# EAGLE design harp expander servo driver v1.0 (EAGLE 9.6.2)
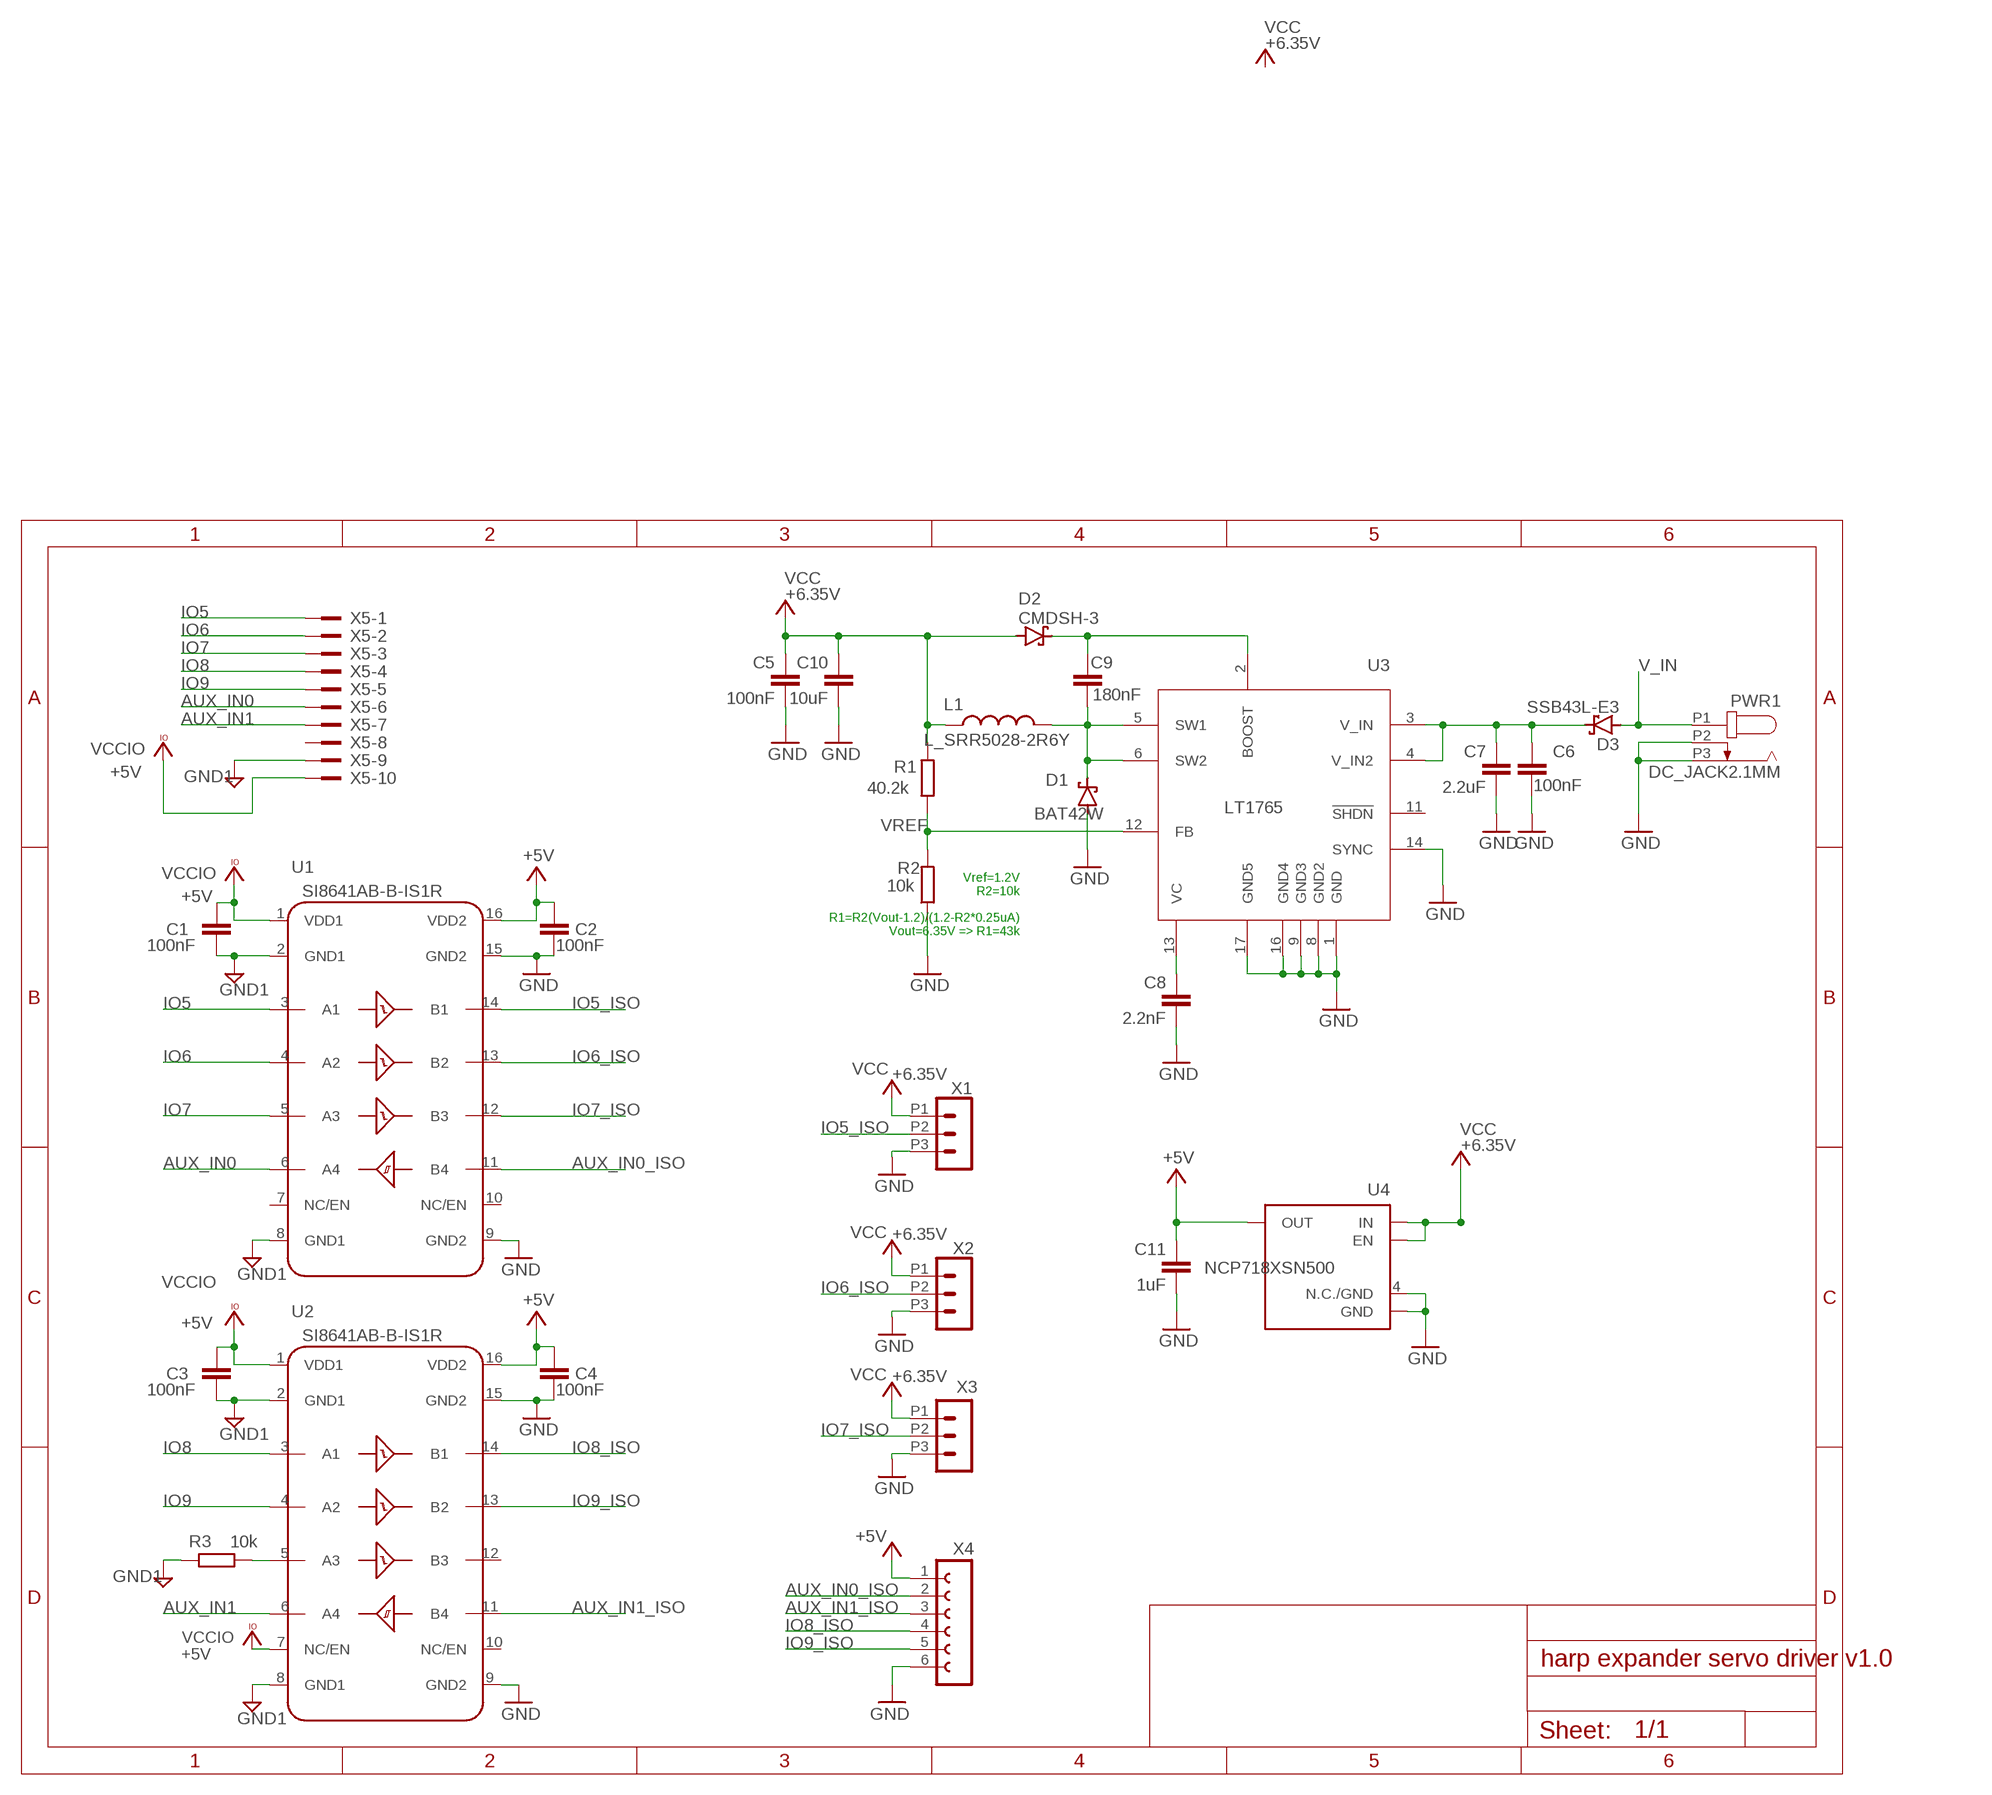
[diagram p0: schematic, sheet 1]

## Parts
C1  100nF  C-EUC0402  [C0402]
C2  100nF  C-EUC0402  [C0402]
C3  100nF  C-EUC0402  [C0402]
C4  100nF  C-EUC0402  [C0402]
C5  100nF  C-EUC0402  [C0402]
C6  100nF  C-EUC0402  [C0402]
C7  2.2uF  C-EUC0603  [C0603]
C8  2.2nF  C-EUC0402  [C0402]
C9  180nF  C-EUC0603  [C0603]
C10  10uF  C-EUC0603  [C0603]
C11  1uF  C-EUC0603  [C0603]
D1  BAT42W  SCHOTTKY-DIODECASE457  [POWERMITE]
D2  CMDSH-3  SCHOTTKY-DIODESOD323  [SOD323-R]
D3  SSB43L-E3  MBRS130LT3  [SMB]
L1  L_SRR5028-2R6Y  [COILCRAFT_1]
PWR1  DC_JACK2.1MM  [DC_POWER_INPUT_2.1MM]
R1  40.2k  R-EU_R0402  [R0402]
R2  10k  R-EU_R0402  [R0402]
R3  10k  R-EU_R0402  [R0402]
U1  SI8641AB-B-IS1R  SI8641ABW  [SO16W]
U2  SI8641AB-B-IS1R  SI8641ABW  [SO16W]
U3  LT1765  [TSSOP16]
U4  NCP718XSN500  [SOT23-5]
X1  CON_3.5MM_1X3  [CON_3.5MM_1X3]
X2  CON_3.5MM_1X3  [CON_3.5MM_1X3]
X3  CON_3.5MM_1X3  [CON_3.5MM_1X3]
X4  aux_header  FE06-1  [FE06]
X5  2510-  [PAK100/2500-10]

## Nets
+5V: C2.1 C4.1 C11.1 U1.16(VDD2) U2.16(VDD2) U4.5(OUT) X4.1
AUX_IN0: U1.6(A4) X5.6
AUX_IN0_ISO: U1.11(B4) X4.2
AUX_IN1: U2.6(A4) X5.7
AUX_IN1_ISO: U2.11(B4) X4.3
GND: C2.2 C4.2 C5.2 C6.2 C7.2 C8.2 C10.2 C11.2 D1.2(A) PWR1.P2 PWR1.P3 R2.1 U1.9(GND2) U1.15(GND2) U2.9(GND2) U2.15(GND2) U3.1(GND) U3.8(GND2) U3.9(GND3) U3.14(SYNC) U3.16(GND4) U3.17(GND5) U4.2(GND) U4.4(N.C./GND) X1.P3 X2.P3 X3.P3 X4.6
GND1: C1.2 C3.2 R3.2 U1.2(GND1) U1.8(GND1) U2.2(GND1) U2.8(GND1) X5.9
IO5: U1.3(A1) X5.1
IO5_ISO: U1.14(B1) X1.P2
IO6: U1.4(A2) X5.2
IO6_ISO: U1.13(B2) X2.P2
IO7: U1.5(A3) X5.3
IO7_ISO: U1.12(B3) X3.P2
IO8: U2.3(A1) X5.4
IO8_ISO: U2.14(B1) X4.4
IO9: U2.4(A2) X5.5
IO9_ISO: U2.13(B2) X4.5
N$2: C6.1 C7.1 D3.C U3.3(V_IN) U3.4(V_IN2)
N$9: R3.1 U2.5(A3)
N$10: C8.1 U3.13(VC)
N$17: C9.2 D1.1(C) L1.2 U3.5(SW1) U3.6(SW2)
N$19: C9.1 D2.C U3.2(BOOST)
V_IN: D3.A PWR1.P1
VCC: C5.1 C10.1 D2.A L1.1 R1.2 U4.1(IN) U4.3(EN) X1.P1 X2.P1 X3.P1
VCCIO: C1.1 C3.1 U1.1(VDD1) U2.1(VDD1) U2.7(NC/EN) X5.10
VREF: R1.1 R2.2 U3.12(FB)
Unconnected: U1.7(NC/EN) U1.10(NC/EN) U2.10(NC/EN) U2.12(B3) U3.7(NC7) U3.10(NC10) U3.11(!SHDN) U3.15(NC15) X5.8

## Notes on the sheet
- Vref=1.2V
  R2=10k
  
  R1=R2(Vout-1.2)/(1.2-R2*0.25uA)
  Vout=6.35V => R1=43k

## Library data of the parts
C1-C6 = rcl:C-EU: CAPACITOR, European symbol; DIGIKEY_PN: 445-6899-2-ND; MPN: CGA2B3X7R1H104K050BB; TYPE: SMD
C7 = rcl:C-EU: CAPACITOR, European symbol; DIGIKEY_PN: 490-12738-1-ND; MPN: GRM188R61E225MA12D; TYPE: SMD
C8 = rcl:C-EU: CAPACITOR, European symbol; DIGIKEY_PN: 1276-1532-6-ND; MPN: CL05B222JB5NNNC; TYPE: SMD
C9 = rcl:C-EU: CAPACITOR, European symbol; DIGIKEY_PN: 490-GCG188R91H184KA01DCT-ND; MPN: GCG188R91H184KA01D; TYPE: SMD
C10 = rcl:C-EU: CAPACITOR, European symbol; DIGIKEY_PN: 587-3238-1-ND; MPN: EMK107BBJ106MA-T; TYPE: SMD
C11 = rcl:C-EU: CAPACITOR, European symbol; DIGIKEY_PN: 1276-1184-1-ND; MPN: CL10B105KA8NNNC; TYPE: SMD
D1 = harp expander servo driver v1.0:SCHOTTKY-DIODE: Schottky Diode; DIGIKEY_PN: BAT42W-E3-08CT-ND; MPN: BAT42W-E3-08; TYPE: SMD
D2 = harp expander servo driver v1.0:SCHOTTKY-DIODE: Schottky Diode; DIGIKEY_PN: 1514-CMDSH-3TRPBFREECT-ND; MPN: CMDSH-3; TYPE: SMD
D3 = diode:MBRS130LT3: Schottky Power Rectifier Source: http://www.onsemi.com/pub/Collateral/MBRS130LT3-D.PDF; DIGIKEY_PN: SSB43L-E3/52TGICT-ND; MPN: SSB43L-E3/52T; VALUE2: DIODE SCHOTTKY 30V 4A DO214AA
L1 = harp expander servo driver v1.0:L_SRR5028-2R6Y; DIGIKEY_PN: SRR5028-2R6YCT-ND; MOUSER_PN: 652-SRR5028-2R6Y; MPN: SRR5028-2R6Y; VALUE2: 2.6uH 3A
PWR1 = harp expander servo driver v1.0:DC_JACK; DIGIKEY_PN: 163-179PH-EX MOUSER; MPN: 163-179PH-EX
R1 = rcl:R-EU_: RESISTOR, European symbol; DIGIKEY_PN: 311-40.2KLRCT-ND; MPN: RC0402FR-0740K2L; TYPE: SMD
R2 R3 = rcl:R-EU_: RESISTOR, European symbol; DIGIKEY_PN: 541-3959-1-ND; MPN: CRCW040210K0FKEDC; TYPE: SMD
U1 U2 = harp expander servo driver v1.0:SI8641AB; DIGIKEY_PN: 336-5212-1-ND; MOUSER_PN: 634-SI8641AB-B-IS1R; MPN: SI8641AB-B-IS1R
U3 = harp expander servo driver v1.0:LT1765; DESCRIPTION: Buck Switching Regulator Output 3A; DIGIKEY_PN: LT1765EFE#TRPBFCT-ND; MPN: LT1765EFE#TRPBF
U4 = harp expander servo driver v1.0:NCP718XSN500; DIGIKEY_PN: NCP718BSN500T1GOSCT-ND; MPN: NCP718BSN500T1G
X1-X3 = harp expander servo driver v1.0:CON_3.5MM_1X3; DIGIKEY_PN: 732-2770-ND; MPN: 691322110003
X4 = con-lsta:FE06-1: FEMALE HEADER; MPN: n.a.; OC_FARNELL: unknown; OC_NEWARK: unknown
X5 = con-3m:2510-: 3M (TM) Pak 100 4-Wall Header Source: 3M; DIGIKEY_PN: S9169-ND; MF: -; MPN: SBH11-PBPC-D05-ST-BK; OC_FARNELL: -; OC_NEWARK: -

## Board
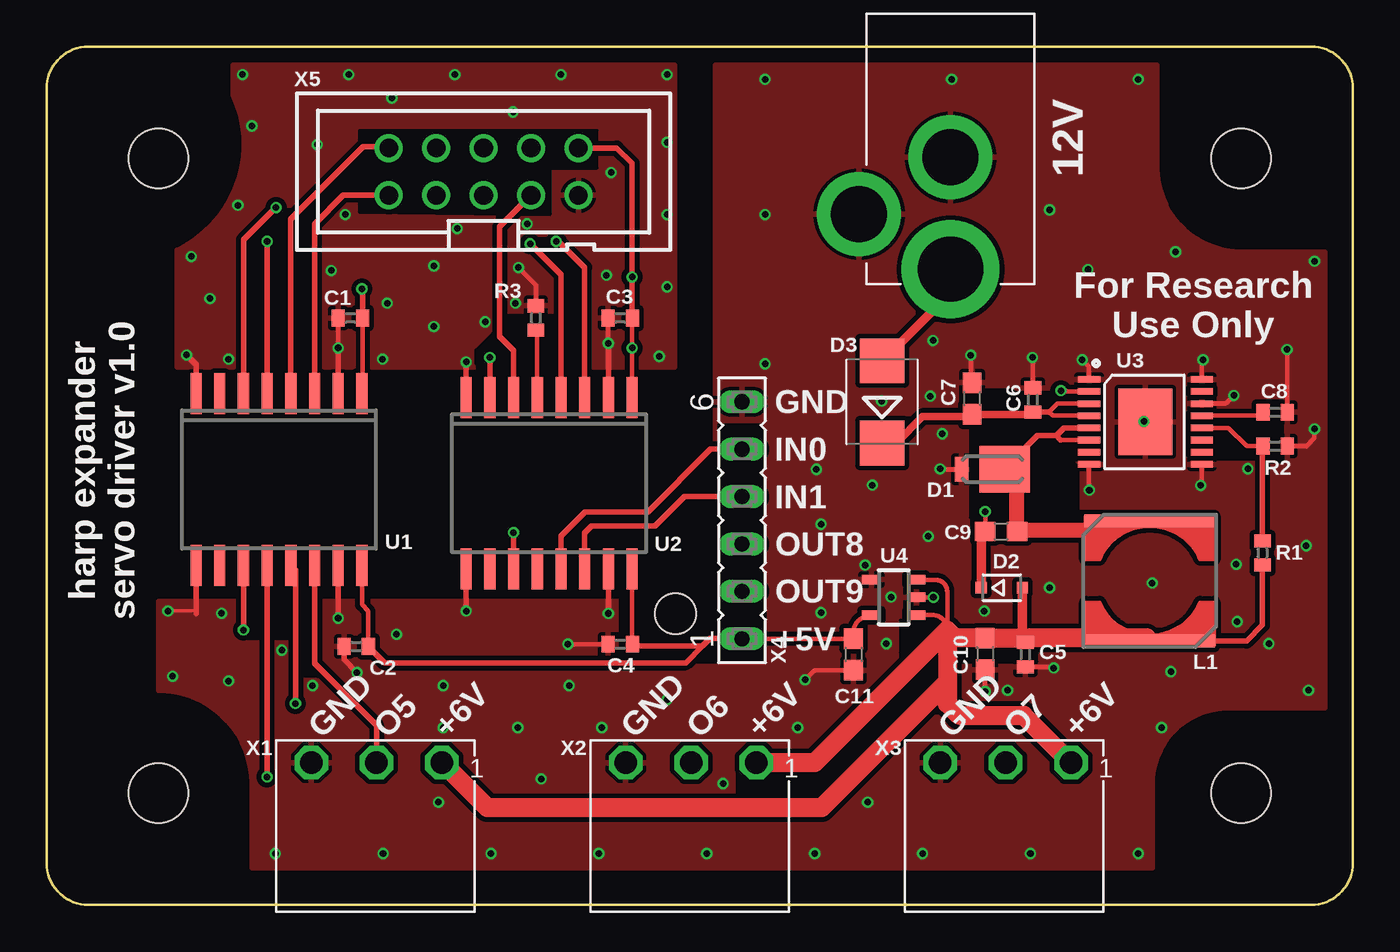
[diagram p1: board, top side]
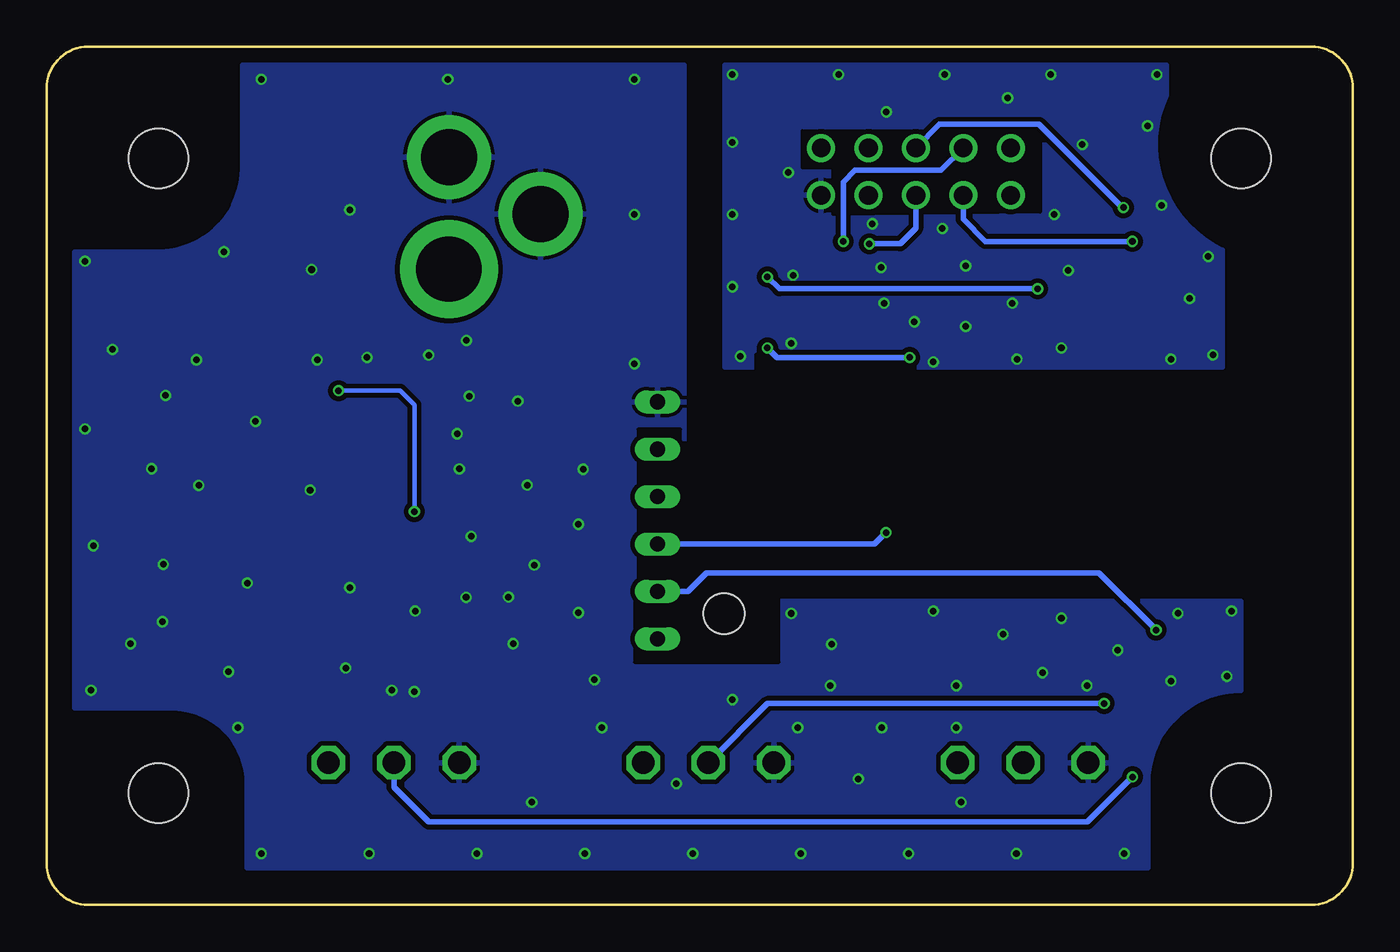
[diagram p2: board, bottom side, seen from below]

Size 70 x 46 mm. Coordinates in mm from the lower left corner, seen from the top.
Outline: 67.76,46 2.24,46 arc90 0,43.76 0,2.24 arc90 2.24,0 67.76,0 arc90 70,2.24 70,43.76 arc90 67.76,46
Copper layers (1*16): Top 0.018mm / dielectric 1.55mm / Bottom 0.018mm
Design rules "eC_2Layer_PClass6_BaseCopperO18_eCDefault *": minimum track width 6mil, minimum drill 0.35mm, track to track 6mil, track to pad 6mil, pad to pad 6mil, via to via 6mil, smd to smd 0mil, copper to edge 0.25mm, drill to drill 0.35mm, minimum pad ring 0.175mm, minimum via ring 0.125mm, stop-mask expansion 0mil, vias tented up to drill 0.45mm, thermal gap 0.2mm
Holes 3.2 mm at 6,40 6,6 64,6 64,40
Holes 2.2 mm at 33.71,15.61

### Footprints (pad centres in the part's own frame; a part is rotated, then mirrored left to right if it is on the bottom)
C0402 = smd 0.7 x 0.9: 1 -0.65,0; 2 0.65,0
C0603 = smd 1.1 x 1: 1 -0.85,0; 2 0.85,0
POWERMITE = smd 2.7 x 2.5: 1 -0.635,0 | smd 0.7 x 1.3: 2 1.665,0
SOD323-R = smd 0.6 x 0.6: A 1.1,0; C -1.1,0
SMB = smd 2.4 x 2.4: A 2.2,0; C -2.2,0
COILCRAFT_1 = smd 6.985 x 0.686: 1 0,3.225; 2 0,-3.225
DC_POWER_INPUT_2.1MM = drill 3.5: P1 8.5,0 | drill 3: P2 2.5,0; P3 5.55,-4.9
R0402 = smd 0.7 x 0.9: 1 -0.65,0; 2 0.65,0
SO16W = smd 0.6 x 2.2: 1 -4.445,-4.6; 2 -3.175,-4.6; 3 -1.905,-4.6; 4 -0.635,-4.6; 5 0.635,-4.6; 6 1.905,-4.6; 7 3.175,-4.6; 8 4.445,-4.6; 9 4.445,4.6; 10 3.175,4.6; 11 1.905,4.6; 12 0.635,4.6; 13 -0.635,4.6; 14 -1.905,4.6; 15 -3.175,4.6; 16 -4.445,4.6
TSSOP16 = smd 0.35 x 1.2: 1 -2.159,-2.897; 2 -1.504,-2.897; 3 -0.854,-2.897; 4 -0.204,-2.897; 5 0.446,-2.897; 6 1.096,-2.897; 7 1.746,-2.897; 8 2.396,-2.897; 9 2.396,3.148; 10 1.746,3.148; 11 1.096,3.148; 12 0.446,3.148; 13 -0.204,3.148; 14 -0.854,3.148; 15 -1.504,3.148; 16 -2.154,3.148 | smd 3.58 x 2.9: 17 0.121,0.126
SOT23-5 = smd 0.5 x 1: 1 -0.95,-1.2; 2 0,-1.2; 3 0.95,-1.2; 4 0.95,1.2; 5 -0.95,1.2
CON_3.5MM_1X3 = drill 1.2 octagon: P1 -3.5,0; P2 0,0; P3 3.5,0
FE06 = drill 0.813 long: 1 -6.35,0; 2 -3.81,0; 3 -1.27,0; 4 1.27,0; 5 3.81,0; 6 6.35,0
PAK100/2500-10 = drill 1 pad 1.422: 1 -5.08,-1.27; 2 -5.08,1.27; 3 -2.54,-1.27; 4 -2.54,1.27; 5 0,-1.27; 6 0,1.27; 7 2.54,-1.27; 8 2.54,1.27; 9 5.08,-1.27; 10 5.08,1.27

### Placement (x,y rotation side)
C1  16.28,31.46 180 top
C2  16.59,13.85 180 top
C3  30.74,31.46 180 top
C4  30.74,13.97 180 top
C5  52.45,13.41 270 top
C6  52.85,27.06 90 top
C7  49.6,27.14 90 top
C8  65.84,26.41 0 top
C9  51.15,20.02 0 top
C10  50.29,13.45 270 top
C11  43.24,13.43 270 top
D1  50.7,23.35 180 top
D2  51.18,17 0 top
D3  44.77,26.96 90 top
L1  59.12,17.37 180 top
PWR1  48.44,42.57 270 top
R1  65.16,18.86 270 top
R2  65.84,24.59 180 top
R3  26.22,31.46 90 top
U1  12.45,22.8 180 top
U2  26.93,22.6 180 top
U3  58.76,26.01 270 top
U4  45.4,16.48 90 top
X1  17.68,7.62 180 top
X2  34.54,7.62 180 top
X3  51.39,7.62 180 top
X4  37.26,20.61 90 top
X5  23.42,39.3 0 top

### Tracks (layer width: path | path; a pad name or v marks a point on that pad's centre or on a via)
+5V
  Top 0.254: X4.1 43.21,14.26 C11.1 43.24,14.57 arc-90 U4.5 | U2.16 31.37,13.98 C4.1 | C2.1 17.24,15.75 16.9,16.09 U1.16
  Top 0.305: C2.1 18.11,12.97 34.26,12.97 35.15,13.87 | X4.1 35.55,14.27 35.15,13.87 | 35.15,13.87 31.49,13.87 C4.1
AUX_IN0  (via drill 0.35)
  Top 0.305: v12.3,37.38 12.27,37.38 10.55,35.65 U1.6
  Bottom 0.305: X5.6 22.15,41.84 16.82,41.84 12.36,37.38 v12.3,37.38
AUX_IN0_ISO  (via drill 0.35)
  Top 0.305: v10.54,14.73 v10.55,14.74 U1.11
  Bottom 0.305: X4.2 35.64,16.8 34.64,17.8 13.61,17.8 v10.54,14.73
AUX_IN1
  Top 0.305: U2.6 25.02,29.7 24.27,30.45 24.27,36.34 X5.7
AUX_IN1_ISO  (via drill 0.35)
  Top 0.305: v25.02,19.95 U2.11
  Bottom 0.305: X4.3 25.63,19.34 v25.02,19.95
GND  (via drill 0.35)
  Top 0.152: 8.01,15.63 8.01,15.75 v6.5,15.75
  Top 0.254: C7.2 49.53,28.06 v49.53,29.46 | D1.2 47.9,23.35 v47.88,23.37 | v66.47,29.77 66.49,29.75 C8.2 | v67.94,25.51 67.94,25.01 67.5,24.57 67.49,24.59 R2.1 | U3.8 55.86,22.25 v55.88,22.23 | U3.9 61.9,22.54 v61.85,22.48 | U3.16 61.9,29.14 v61.98,29.21 | U3.14 63.19,26.86 v63.63,27.3 | U4.2 v47.52,16.48 | v47.52,16.48 | C6.2 52.85,29.32 v52.83,29.34 | U3.1 55.86,28.85 v55.5,29.21 | C5.2 53.91,12.77 v53.98,12.7 | C10.2 v50.29,11.43 | C11.2 41.15,12.58 v40.64,12.06 | C4.2 v27.94,13.97
  Top 0.305: U1.9 8.01,15.63 8,15.62 | U2.9 v22.48,15.75 | v16.64,12.45 15.94,13.14 C2.2 | U1.15 v15.63,15.37 v15.62,15.37 | U2.15 v30.1,15.63 v30.1,15.62
  other vias: 58.8,25.91 43.87,18.21 6.75,12.25 12.25,2.75 18.03,2.75 9.75,12 23.81,2.75 29.59,2.75 35.38,2.75 41.16,2.75 46.94,2.75 52.72,2.75 58.5,2.75 67.62,11.5 67.5,19.25 67.95,34.5 59.75,9.5 59.25,17.25 53.75,17 50.25,15.75 47.25,19.75 45.25,16.5 38.5,44.25 48.5,44.25 58.5,44.25 38.5,37 38.5,29 60.5,35 53.75,37.25 55.8,34.05 18.75,14.5 12.6,13.65 51.5,11.5 60.25,12.5 65.5,14 41.5,20.41 41.25,23.34 44.25,22.5 36.25,6.5 64.38,23.38 63.8,15.18 63.75,18.25 14.25,11.75 9.38,15.62 21.25,11.75 28,11.75 33.25,11 26.5,6.75 21.25,9.5 29.75,9.5 25.25,9.5 44,5.5 21,5.5 40.25,9.5 47.5,30.25 44.75,27 47.36,27.27 48,25.25 41.5,15.66 45,14
  pour Top (isolate 0.254): 6,16.26 35.84,16.26 35.84,45 59.5,45 59.5,39.5 arc90 64,35 68.5,35 68.5,10.56 63.31,10.56 arc90 59.25,6.5 59.25,2 11,2 11,6.5 arc90 6,11.5
  pour Bottom (isolate 0.254): 6,16.26 35.84,16.26 35.84,45 59.5,45 59.5,39.5 arc90 64,35 68.5,35 68.5,10.56 63.31,10.56 arc90 59.25,6.5 59.25,2 11,2 11,6.5 arc90 6,11.5
GND1  (via drill 0.35)
  Top 0.254: C1.2 15.63,29.86 v15.62,29.84 | v30.1,30.1 30.09,30.11 C3.2 | R3.2 26.21,33.23 v25.29,34.16
  Top 0.305: U1.8 8.01,28.97 v7.5,29.47 | U2.8 v22.48,29.09 v22.48,29.1 | U2.2 v30.1,30.09 30.09,30.11 | U1.2 v15.63,29.84 v15.62,29.84
  other vias: 32.83,29.4 7.75,34.75 10.25,37.5 10.5,44.5 11,41.75 16.19,44.5 21.88,44.5 27.56,44.5 33.25,44.5 33.25,40.88 33.25,37 33.25,33.12 16,37 15.25,34 18,29.25 30,33.75 23.5,31.25 18.25,32.25 20.75,34.25 20.75,31 9.75,29.25 8.75,32.5 14.5,40.75 25.75,36.5 25.12,32.25 22,36.25 25,42.5 18.5,43.25 30.25,39.25
  pour Bottom (isolate 0.254): 33.66,45 10,45 10,43.43 arc-90 6.99,35.1 6.99,28.83 33.66,28.83
  pour Top (isolate 0.254): 33.66,45 10,45 10,43.43 arc-90 6.99,35.1 6.99,28.83 33.66,28.83
IO5
  Top 0.305: U1.3 14.36,30.73 14.35,30.73 14.35,36.5 15.88,38.03 X5.1
IO5_ISO
  Top 0.305: U1.14 14.36,12.95 17.68,9.63 X1.P2
IO6
  Top 0.305: U1.4 13.09,30.09 13.08,30.1 13.08,36.75 16.97,40.64 18.34,40.64 X5.2
IO6_ISO  (via drill 0.35)
  Top 0.305: U1.13 13.34,17.95 v13.34,10.79
  Bottom 0.305: v13.34,10.79 31.36,10.79 X2.P2
IO7  (via drill 0.35)
  Top 0.305: U1.5 v11.82,35.56
  Bottom 0.305: v11.82,35.56 19.69,35.56 20.88,36.75 X5.3
IO7_ISO  (via drill 0.35)
  Top 0.305: v11.81,6.86 v11.82,6.86 U1.12
  Bottom 0.305: X3.P2 51.39,6.31 49.53,4.45 14.22,4.45 v11.81,6.86
IO8  (via drill 0.35)
  Top 0.305: U2.3 28.83,34.16 27.43,35.56 v27.3,35.56
  Bottom 0.305: v27.3,35.56 27.3,38.73 26.67,39.37 22.08,39.37 X5.4
IO8_ISO
  Top 0.305: U2.14 28.83,19.94 29.21,20.32 32.61,20.32 34.17,21.88 X4.4
IO9  (via drill 0.35)
  Top 0.305: v25.91,35.43 27.56,33.78 U2.4
  Bottom 0.305: X5.5 23.42,36.27 24.26,35.43 v25.91,35.43
IO9_ISO
  Top 0.305: X4.5 35.59,24.42 32.23,21.06 28.86,21.06 27.56,19.77 U2.13
N$1
  cutout Top: 2.5,40 arc-90 6,43.5 arc-90 9.5,40 arc-90 6,36.5 arc-90
N$2
  Top 0.254: U3.4 53.92,26.21 53.72,26.41 54.17,26.86 U3.3
  Top 0.305: 52.72,26.29 C6.1 53.72,26.41
  Top 0.406: D3.C 45.54,24.76 46.94,26.16 49.48,26.16 C7.1 52.72,26.29
N$3
  cutout Top: 2.5,6 arc-90 6,9.5 arc-90 9.5,6 arc-90 6,2.5 arc-90
N$4
  cutout Top: 60.5,40 arc-90 64,43.5 arc-90 67.5,40 arc-90 64,36.5 arc-90
N$5
  cutout Top: 60.5,6 arc-90 64,9.5 arc-90 67.5,6 arc-90 64,2.5 arc-90
N$6
  cutout Bottom: 60.5,40 arc-90 64,43.5 arc-90 67.5,40 arc-90 64,36.5 arc-90
N$7
  cutout Bottom: 60.5,6 arc-90 64,9.5 arc-90 67.5,6 arc-90 64,2.5 arc-90
N$8
  cutout Bottom: 2.5,6 arc-90 6,9.5 arc-90 9.5,6 arc-90 6,2.5 arc-90
N$9
  Top 0.254: U2.5 26.29,30.73 R3.1
N$10
  Top 0.254: U3.13 65,26.21 C8.1
N$11
  cutout Bottom: 2.5,40 arc-90 6,43.5 arc-90 9.5,40 arc-90 6,36.5 arc-90
N$12
  cutout Bottom: 36.03,25.5 38.31,25.5 38.31,13 36.03,13
N$13
  cutout Top: 36.03,25.75 38.31,25.75 38.31,13.25 36.03,13.25
N$14
  cutout Top: 47,17.25 48,17.25 48,15.5 47,15.5
N$15
  cutout Top: 37,7.75 37,5.75 38.5,5.75 38.5,6.25
N$16
  cutout Top: 49.5,25.75 49.5,20.75 49.75,20.5 51.5,20.5 51.75,20.75 51.75,25.5 51.25,26 49.75,26
N$17
  Top 0.254: U3.6 54.33,24.91
  Top 0.305: 54.1,25.15 53.09,25.15 51.33,23.39 | 54.33,24.91 54.1,25.15 | U3.5 54.52,25.56 54.1,25.15
  Top 0.508: L1.2 57.21,20.59 56.69,20.07
  Top 0.813: C9.2 52,20.07 | 52,20.07 52,22.68 D1.1 51.33,23.39 | 56.69,20.07 52,20.07
N$18
  cutout Top: 55.25,20.5 50,20.5 50,24.25 53.75,24.25 54.25,24.5 55.25,23.5
N$19  (via drill 0.35)
  Top 0.254: C9.1 50.3,21.07 v50.29,21.08 | v54.36,27.56 54.61,27.56 54.66,27.51 U3.2
  Top 0.406: 50.09,19.8 C9.1
  Top 0.508: D2.C 50.09,19.8
  Bottom 0.254: v54.36,27.56 51.05,27.56 50.29,26.8 v50.29,21.08
N$20
  cutout Top: 49,27.62 51.75,27.62 51.75,27.5 55,27.5 55,26.5 49,26.5
N$21
  cutout Top: 65.5,23.75 66.25,23.75 66.25,27 65.5,27
N$22
  cutout Top: 62.5,23.88 62.5,25.25 64,25.25 65.38,23.88
N$23
  cutout Top: 14.75,12.25 13.5,12.25 13.5,13.25 14.5,13.25 14.5,12.25
N$24
  cutout Top: 13.75,14.25 10.5,14.25 10.5,15.5 13.75,15.5
N$25
  cutout Bottom: 29.5,39.5 29.5,41.5 16.75,41.5 16.75,37.12 27.88,37 27.88,39.5
N$26
  cutout Top: 24.5,31.62 27.25,31.62 27.25,30.5 24.5,30.5
N$27
  cutout Top: 29.5,39.5 29.5,41.5 16.75,41.5 16.75,37.12 27,37.01 27,39.5
N$28
  cutout Bottom: 32,28.5 32,29.5 31.5,30 30.75,29.25 30.75,28.75 31,28.5
N$29
  cutout Top: 24.75,28.75 23.25,28.75 23,29 23,29.75 24.75,31.5
N$30
  cutout Bottom: 30.75,17 38.5,17 38.5,13 30.75,13
N$31
  cutout Top: 30.75,17 38.5,17 38.5,13 30.75,13
N$32
  cutout Top: 26,35.75 27.25,35.75 27.25,35 26.75,35
N$33
  cutout Top: 49,13.03 53.08,13.03 53.08,13.5 49,13.5
N$34
  cutout Top: 45.75,13.53 46.5,13.53 46.5,15.25 45.75,15.25
V_IN
  Top 0.508: PWR1.P1 48.44,32.8 44.8,29.16 D3.A
VCC
  Top 0.254: C5.1 52.28,14.23 | 48.26,14.75 48.26,14.73 48.26,14.7 | X1.P1 21.21,7.62 | U4.1 47.48,15.53 arc-90 48.26,14.75 | 48.26,14.75 48.26,16.79 arc90 47.62,17.43 U4.3 arc-90 U4.3
  Top 0.305: R1.2 65.16,14.99 64.31,14.14 L1.1
  Top 0.508: 52.28,14.23 D2.A | 52.45,14.3 C5.1 52.7,14.32
  Top 0.61: L1.1 58.94,14.32
  Top 1.016: 48.26,14.73 41.15,7.62 X2.P1 | X3.P1 52.35,10.16 48.9,10.16 48.26,10.79 48.26,11.94 | 48.26,11.94 48.26,14.7 48.66,14.3 C10.1 52.45,14.3 | 48.26,11.94 41.53,5.21 23.62,5.21 21.21,7.62 | 58.94,14.32 52.7,14.32
VCCIO  (via drill 0.35)
  Top 0.254: U2.1 v31.37,29.84 31.37,31.44 C3.1 | C1.1 16.93,27.43 U1.1
  Top 0.305: X5.10 30.55,40.57 31.37,39.75 v31.37,33.66 31.37,31.44 | C1.1 16.93,32.98 v16.89,33.02 | U2.7 v23.75,29.33 v23.75,29.34
  Bottom 0.305: v16.89,33.02 30.74,33.02 v31.37,33.66 | v23.75,29.34 30.87,29.34 v31.37,29.84
VREF
  Top 0.254: U3.12 63.34,25.56 64.31,24.59 R2.2 65.16,24.56
  Top 0.305: 65.16,24.56 R1.1

### Text on the board
tPlace: 12V | GND | IN0 | IN1 | OUT8 | OUT9 | +5V | GND | O5 | +6V | GND | O6 | +6V | GND | O7 | +6V
tNames: For Research / Use Only | harp expander / servo driver v1.0